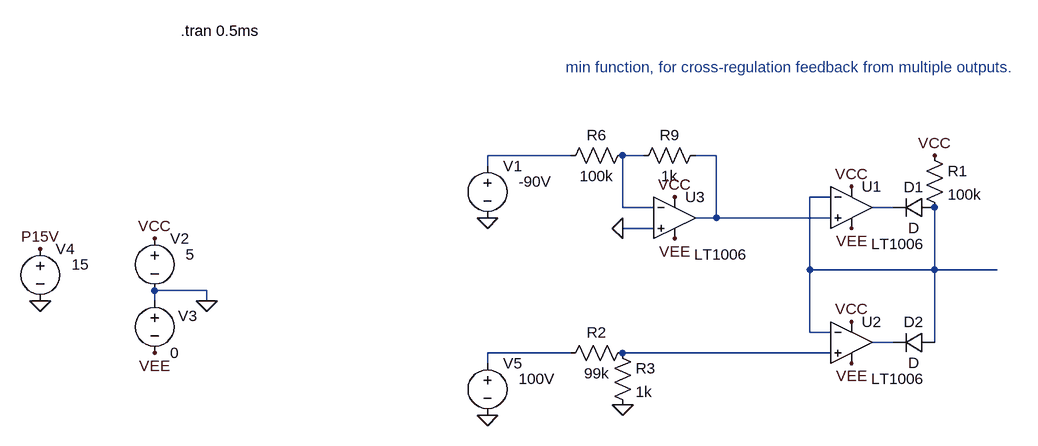
[diagram p0: schematic Draft79.asc]
Draft79.asc, the LTspice schematic file:
Version 4
SHEET 1 5720 1740
WIRE 432 -32 304 -32
WIRE 544 -32 512 -32
WIRE 656 -32 624 -32
WIRE 304 -16 304 -32
WIRE 832 32 800 32
WIRE 512 48 512 -32
WIRE 560 48 512 48
WIRE 928 48 896 48
WIRE 656 64 656 -32
WIRE 656 64 624 64
WIRE 832 64 656 64
WIRE 560 80 512 80
WIRE 800 144 800 32
WIRE 992 144 992 48
WIRE 992 144 800 144
WIRE 1088 144 992 144
WIRE -128 176 -208 176
WIRE -208 192 -208 176
WIRE -128 192 -128 176
WIRE 800 240 800 144
WIRE 832 240 800 240
WIRE 928 256 896 256
WIRE 992 256 992 144
WIRE 432 272 304 272
WIRE 832 272 512 272
WIRE 304 288 304 272
FLAG -128 192 0
FLAG -208 96 VCC
FLAG -208 272 VEE
FLAG -384 192 0
FLAG -384 112 P15V
FLAG 592 32 VCC
FLAG 592 96 VEE
FLAG 512 80 0
FLAG 304 64 0
FLAG 864 16 VCC
FLAG 864 80 VEE
FLAG 864 224 VCC
FLAG 864 288 VEE
FLAG 304 368 0
FLAG 512 352 0
FLAG 992 -32 VCC
SYMBOL voltage -208 80 R0
WINDOW 123 0 0 Left 0
WINDOW 39 0 0 Left 0
WINDOW 3 48 40 Left 2
SYMATTR Value 5
SYMATTR InstName V2
SYMBOL voltage -208 176 R0
WINDOW 123 0 0 Left 0
WINDOW 39 0 0 Left 0
WINDOW 0 36 39 Left 2
SYMATTR InstName V3
SYMATTR Value 0
SYMBOL voltage -384 96 R0
WINDOW 123 0 0 Left 0
WINDOW 39 0 0 Left 0
WINDOW 3 48 40 Left 2
SYMATTR Value 15
SYMATTR InstName V4
SYMBOL OpAmps\\LT1006 592 0 R0
WINDOW 3 30 120 Left 2
SYMATTR InstName U3
SYMBOL res 416 -16 R270
WINDOW 0 32 56 VTop 2
WINDOW 3 0 56 VBottom 2
SYMATTR InstName R6
SYMATTR Value 100k
SYMBOL res 640 -48 R90
WINDOW 0 0 56 VBottom 2
WINDOW 3 32 56 VTop 2
SYMATTR InstName R9
SYMATTR Value 1k
SYMBOL voltage 304 -32 R0
WINDOW 123 0 0 Left 0
WINDOW 39 0 0 Left 0
WINDOW 3 48 40 Left 2
SYMATTR Value -90V
SYMATTR InstName V1
SYMBOL OpAmps\\LT1006 864 -16 R0
WINDOW 3 30 120 Left 2
SYMATTR InstName U1
SYMBOL OpAmps\\LT1006 864 192 R0
WINDOW 3 30 120 Left 2
SYMATTR InstName U2
SYMBOL diode 992 32 R90
WINDOW 0 0 32 VBottom 2
WINDOW 3 32 32 VTop 2
SYMATTR InstName D1
SYMBOL diode 992 240 R90
WINDOW 0 0 32 VBottom 2
WINDOW 3 32 32 VTop 2
SYMATTR InstName D2
SYMBOL res 976 -48 R0
SYMATTR InstName R1
SYMATTR Value 100k
SYMBOL voltage 304 272 R0
WINDOW 123 0 0 Left 0
WINDOW 39 0 0 Left 0
WINDOW 3 48 40 Left 2
SYMATTR Value 100V
SYMATTR InstName V5
SYMBOL res 416 288 R270
WINDOW 0 32 56 VTop 2
WINDOW 3 0 56 VBottom 2
SYMATTR InstName R2
SYMATTR Value 99k
SYMBOL res 496 256 R0
SYMATTR InstName R3
SYMATTR Value 1k
TEXT -168 -224 Left 2 !.tran 0.5ms
TEXT 424 -168 Left 2 ;min function, for cross-regulation feedback from multiple outputs.

The netlist it stands for:
* Draft79.asc
V2 VCC 0 5
V3 0 VEE 0
V4 P15V 0 15
XU3 0 N002 VCC VEE N003 LT1006  ; pins In+ In- V+ V- OUT
R6 N001 N002 100k
R9 N003 N002 1k
V1 N001 0 -90V
XU1 N003 N004 VCC VEE N005 LT1006  ; pins In+ In- V+ V- OUT
XU2 N008 N004 VCC VEE N006 LT1006  ; pins In+ In- V+ V- OUT
D1 N004 N005 D
D2 N004 N006 D
R1 VCC N004 100k
V5 N007 0 100V
R2 N007 N008 99k
R3 N008 0 1k
.model D D
.lib standard.dio
.tran 0.5ms
* min function, for cross-regulation feedback from multiple outputs.
.lib LTC.lib
.backanno
.end